# EasyEDA Pro project Tb66_and_DRV88_Teensy_LFR_PCB.epro, board PCB17
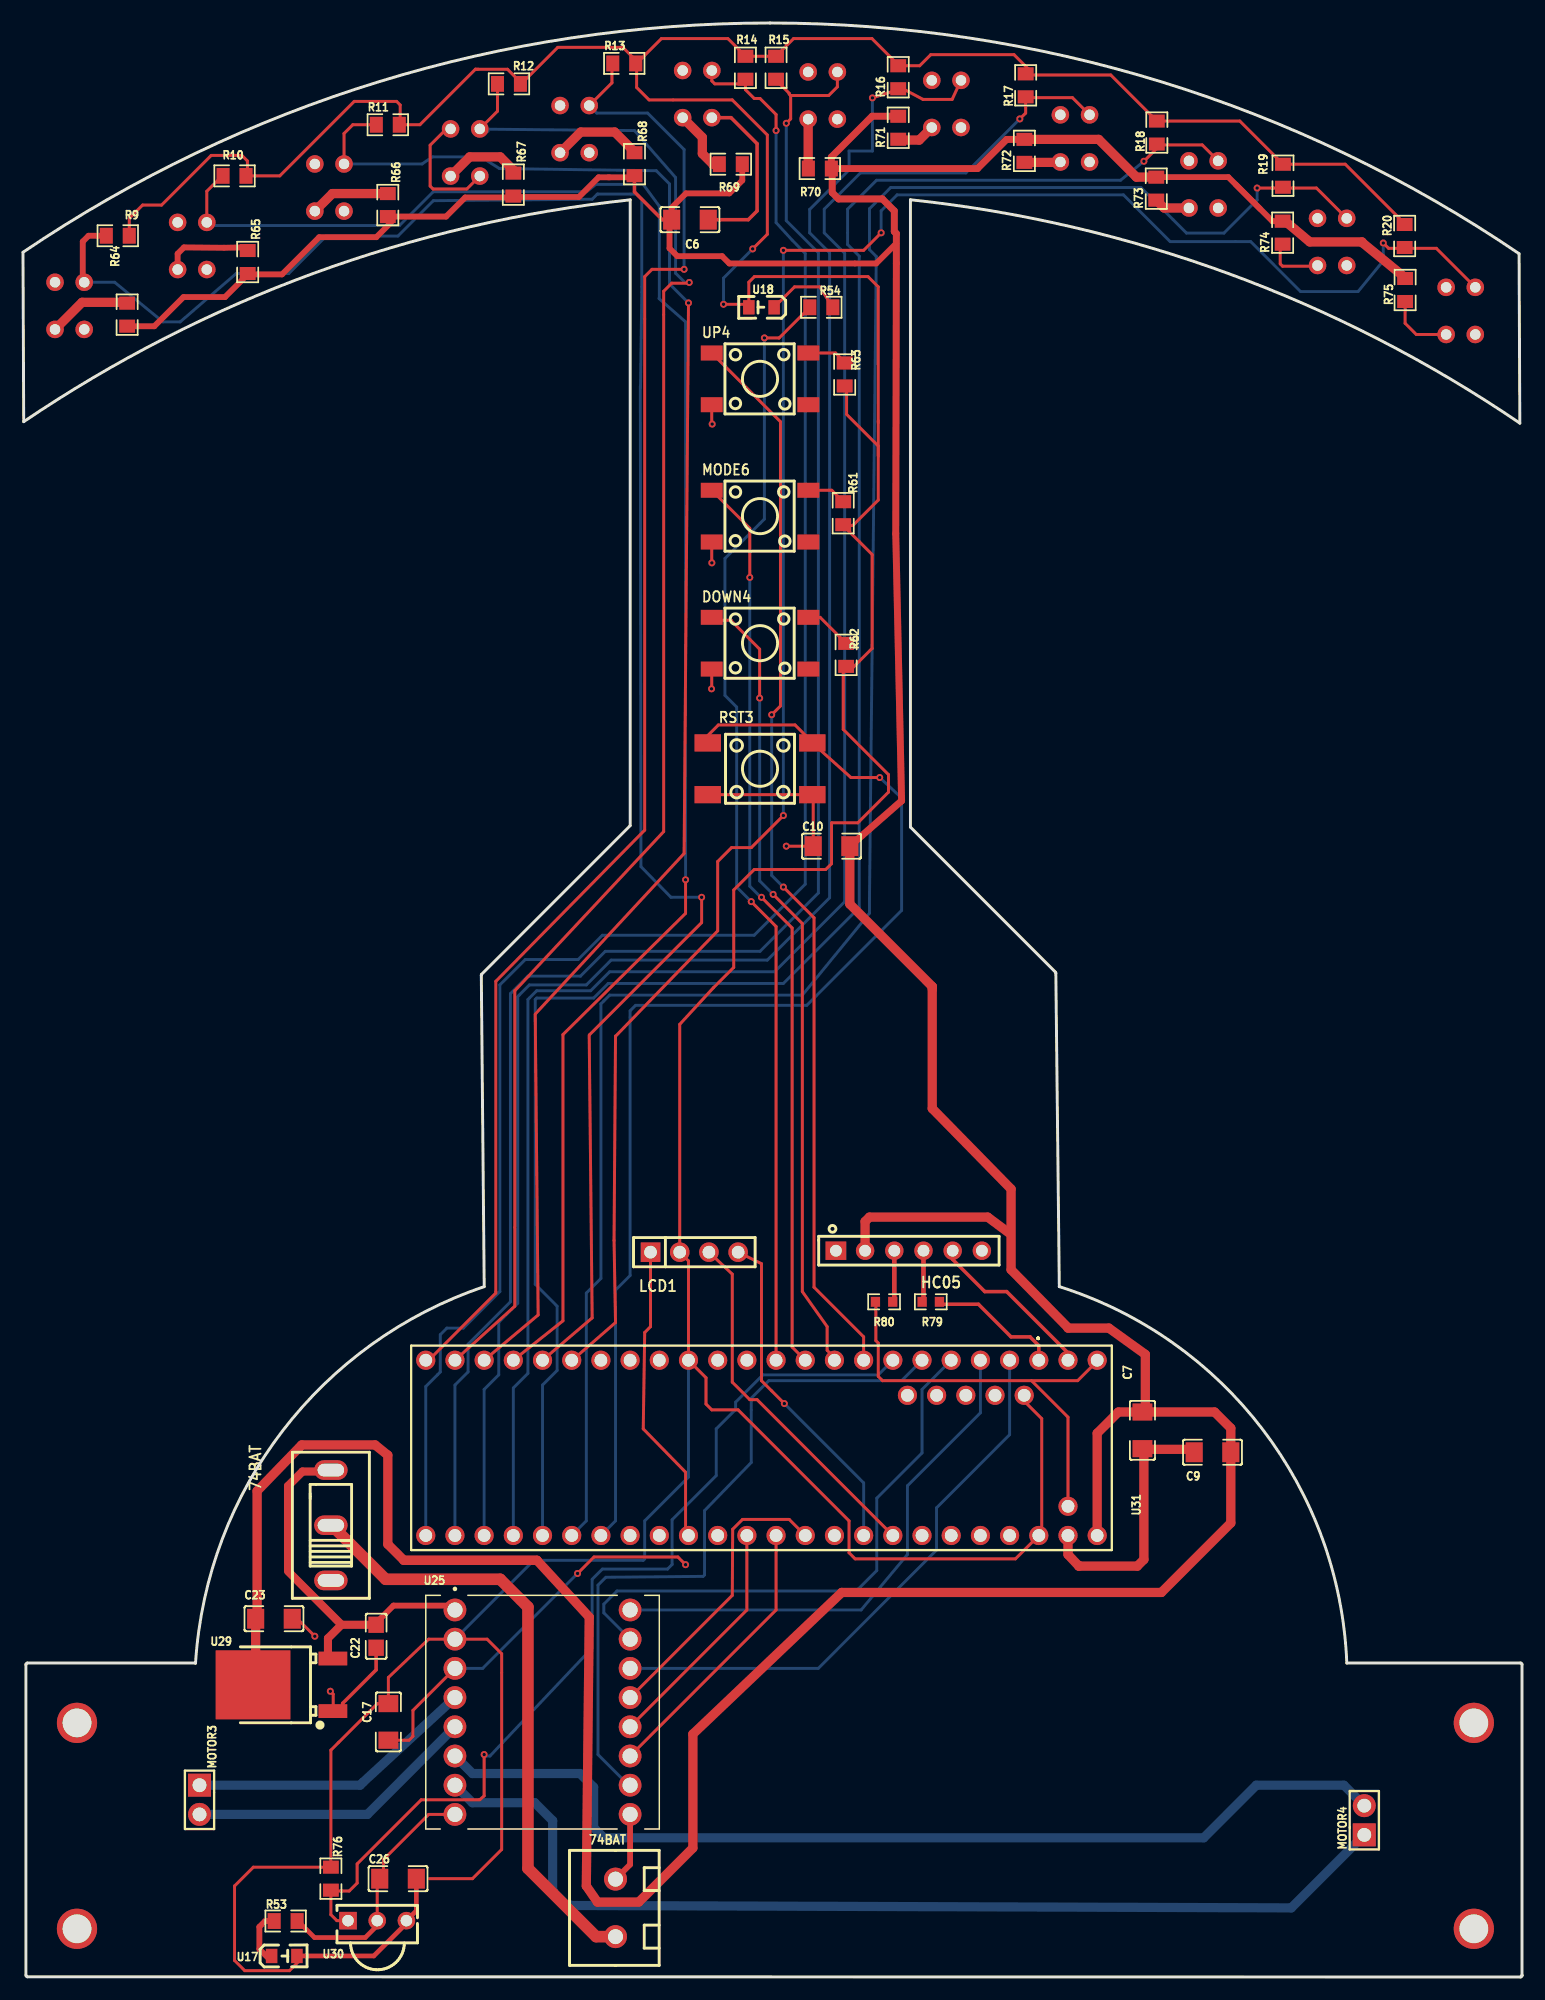
[diagram p2: board, top side]
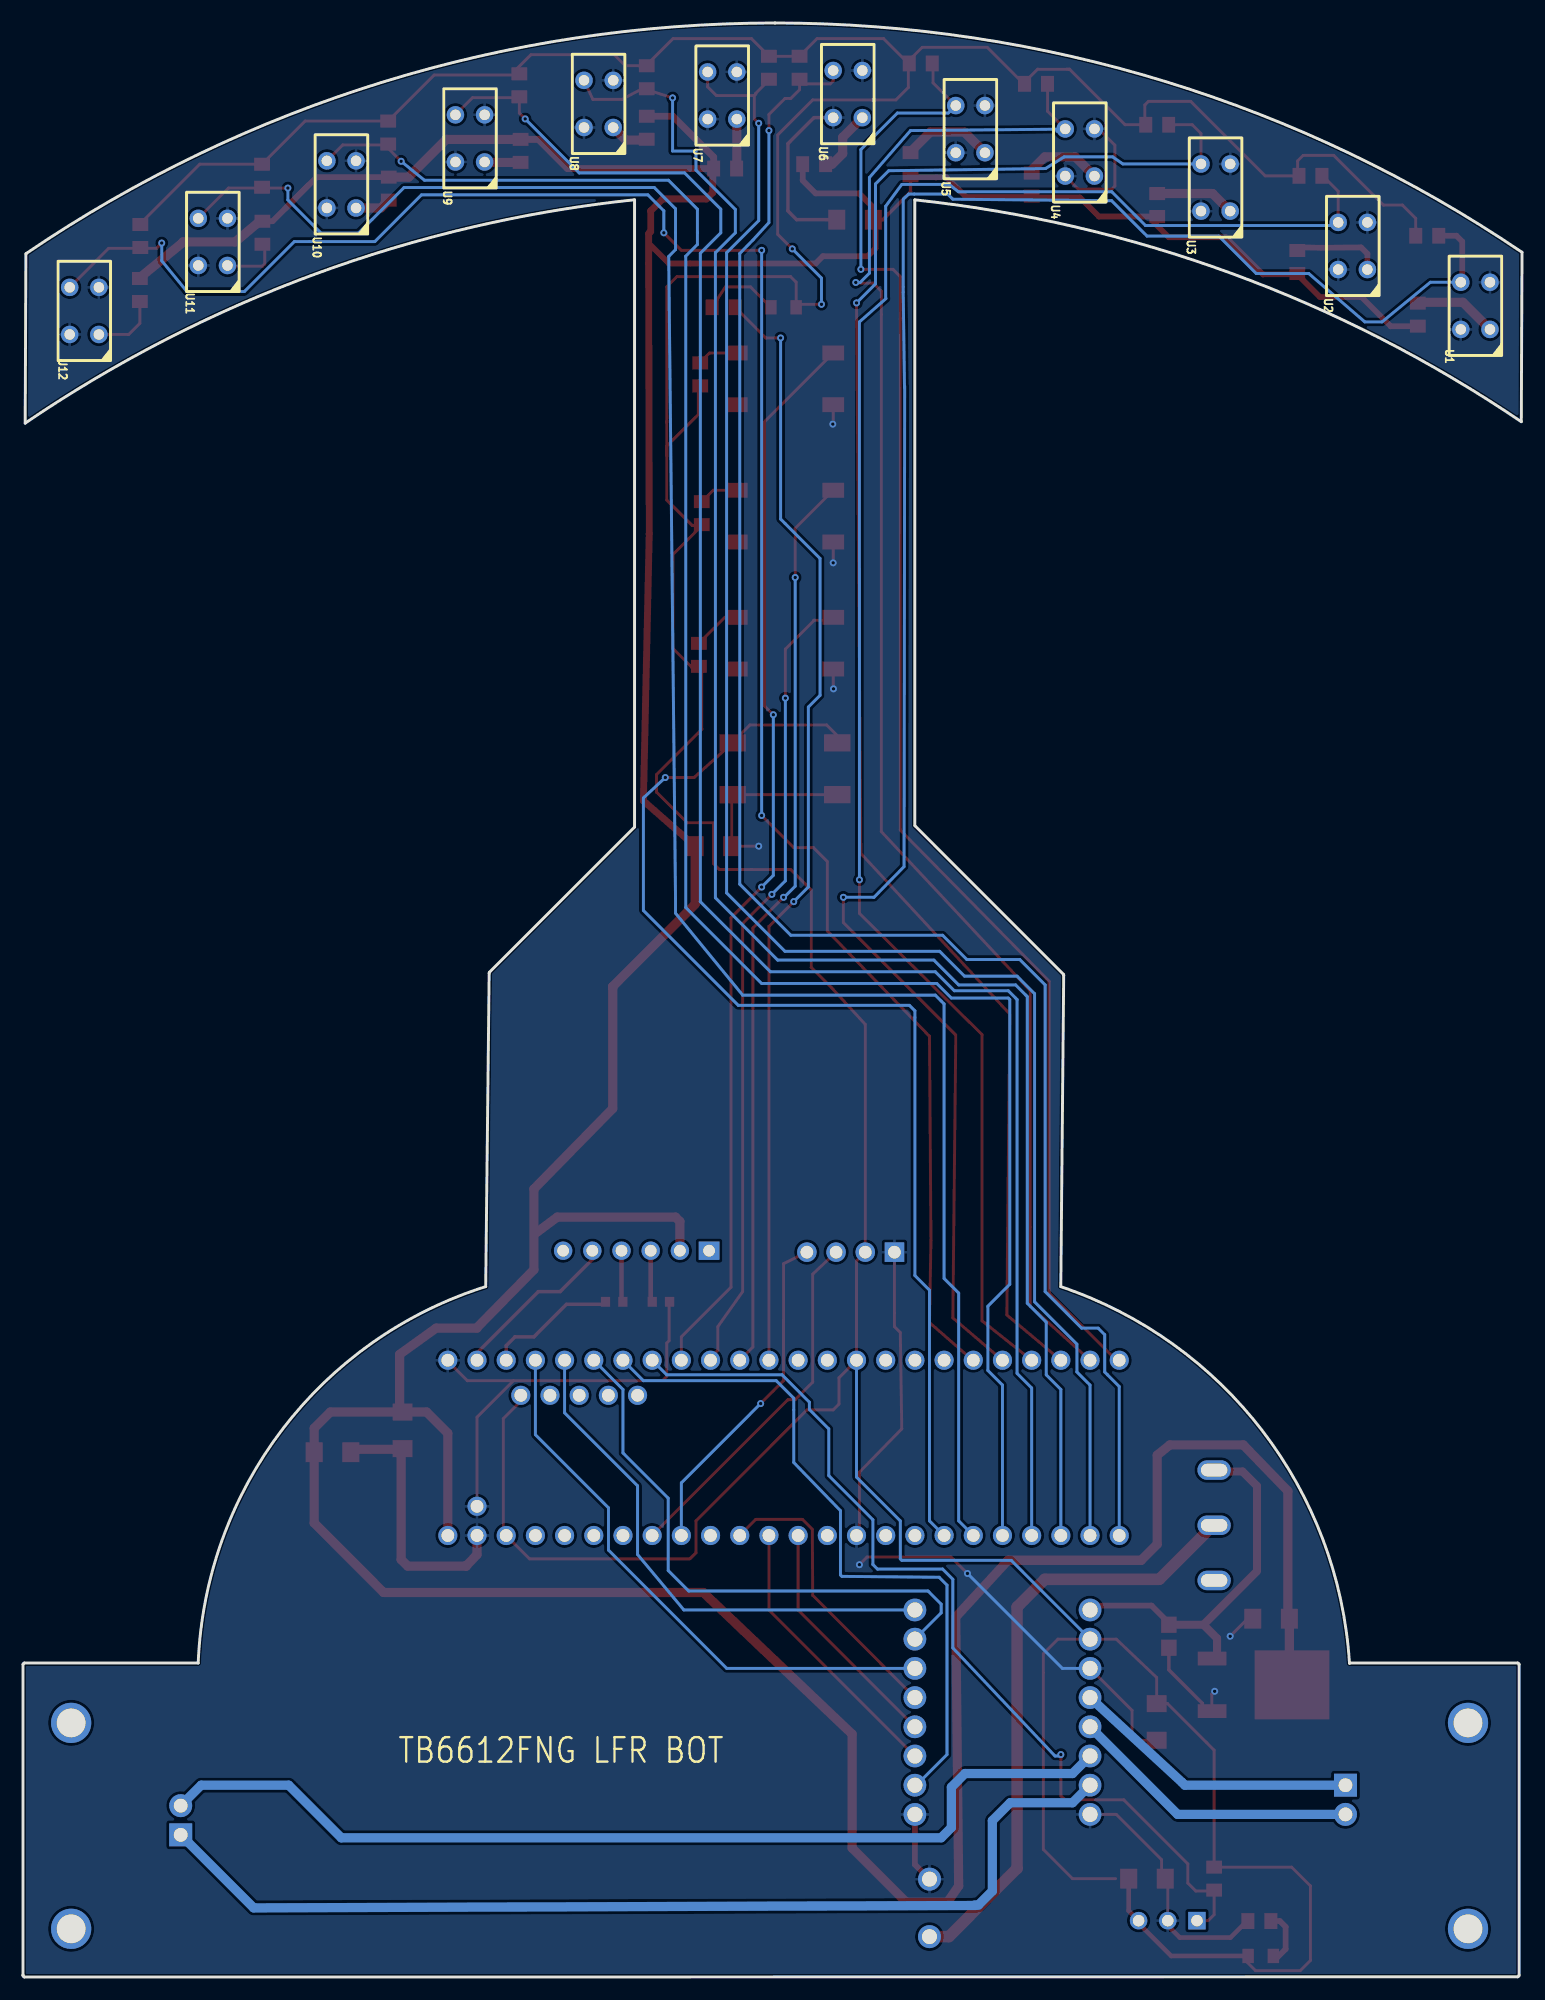
[diagram p3: board, bottom side, seen from below]

Outline 130.43 x 169.93 mm; copper layers: Top Layer, Bottom Layer. Coordinates in mm from the lower left corner of the outline.
Outline path: 0,149.99 arc(31,164.83) 64.99,169.93 arc(99.09,164.8) 130.18,149.86 130.24,135.13 arc(104.93,148.12) 77.22,154.55 77.22,100 89.83,87.39 arc(89.86,87.35) 89.87,87.3 90.17,60.04 arc(107.85,47.63) 115.18,27.31 130.3,27.31 arc(130.39,27.27) 130.43,27.18 130.43,0.18 arc(130.43,0.17) 130.43,0.15 arc(130.43,0.14) 130.43,0.13 arc(130.39,0.04) 130.3,0 0.38,0.02 arc(0.29,0.06) 0.25,0.15 0.25,27.18 arc(0.29,27.27) 0.38,27.31 14.99,27.31 arc(15,27.3) 15.01,27.3 arc(22.59,47.49) 40.13,60.03 39.88,87.12 arc(39.88,87.12) 39.88,87.12 arc(39.89,87.17) 39.92,87.21 52.83,100.13 52.83,154.55 arc(25.26,148.15) 0.06,135.25 0,149.99
Stack: Top Layer 0.035mm / Dielectric1 1.51mm FR4 er 4.5 / Bottom Layer 0.035mm

## Design rules (mm)
template: Custom Config
spacing copperThickness1oz (default): track to track 0.3, other pairs 0.152 to 0.3
spacing copperThickness2oz: track to track 0.203, other pairs 0.152 to 0.3
track width copperThickness1oz (default): min 0.127, default 0.254, max 2.54
track width copperThickness2oz: min 0.203, default 0.254, max 2.54
differential pair differentialPair (default): width min 0.127, default 0.254, max 2.54; gap min 0.152, default 0.152
via viaSize (default): diameter min 0.5, default 0.61, max 10; hole min 0.3, default 0.305, max 6.3

## Placement (name value [footprint] x y rotation side)
74BAT  7.4V BAT  [SW-TH_SHOU-HAN_SS12D10G4]  26.79 39.28 90 top
74BAT#2  SS12D10G4 071  [CONN-TH_WJ126V-5.0-2P]  51.56 6.01 180 top
C6  100nF  [C1206]  58.03 152.82 180 top
C7  100nF  [C1206]  97.4 47.54 90 top
C9  100nF  [C1206]  103.5 45.63 0 top
C10  100nF  [C1206]  70.35 98.34 0 top
C17  100nF  [C1206]  31.79 22.18 90 top
C22  10uF  [C0805]  30.73 29.63 90 top
C23  47uF  [C1206]  21.84 31.16 180 top
C26  100nF  [C1206]  32.63 8.55 0 top
DOWN4  TS-1002S-05026C  [KEY-SMD_4P-L6.0-W6.0-P4.50-LS9.0]  64.13 115.99 0 top
HC05  HC-05  [HDR-TH_6P-P2.54-V-F]  77.08 63.16 0 top
LCD1  LCD  [HDR-TH_4P-P2.54-V-F]  58.41 63.03 0 top
MODE6  TS-1002S-05026C  [KEY-SMD_4P-L6.0-W6.0-P4.50-LS9.0]  64.13 127.04 0 top
MOTOR3  MOTOR1  [HDR-TH_2P-P2.54-V-M]  15.36 15.41 270 top
MOTOR4  MOTOR2  [HDR-TH_2P-P2.54-V-M]  116.71 13.63 90 top
NOREF  -  [Pad_e6375]  126.24 22.1 0 top
NOREF#2  -  [Pad_e6377]  4.7 22.1 0 top
NOREF#3  -  [Pad_e6376]  126.24 4.19 0 top
NOREF#4  -  [Pad_e6378]  4.7 4.19 0 top
R9  47kΩ  [R0805]  8.25 151.43 180 top
R10  47kΩ  [R0805]  18.41 156.63 0 top
R11  47kΩ  [R0805]  31.74 161.08 0 top
R12  47kΩ  [R0805]  42.28 164.63 180 top
R13  47kΩ  [R0805]  52.32 166.41 0 top
R14  47kΩ  [R0805]  62.86 166.03 90 top
R15  47kΩ  [R0805]  65.53 166.03 270 top
R16  47kΩ  [R0805]  76.15 165.21 90 top
R17  47kΩ  [R0805]  87.24 164.51 90 top
R18  47kΩ  [R0805]  98.65 160.4 270 top
R19  47kΩ  [R0805]  109.63 156.65 90 top
R20  47kΩ  [R0805]  120.22 151.4 90 top
R53  470Ω  [R0805]  22.85 4.87 180 top
R54  470Ω  [R0805]  69.46 145.2 0 top
R61  10kΩ  [R0805]  71.37 127.3 270 top
R62  10kΩ  [R0805]  71.62 114.98 90 top
R63  10kΩ  [R0805]  71.49 139.36 270 top
R64  187Ω  [R0805]  9.06 144.56 270 top
R65  187Ω  [R0805]  19.55 149.14 270 top
R66  187Ω  [R0805]  31.74 154.09 270 top
R67  187Ω  [R0805]  42.67 155.87 270 top
R68  187Ω  [R0805]  53.21 157.65 270 top
R69  187Ω  [R0805]  61.59 157.65 0 top
R70  187Ω  [R0805]  69.34 157.27 0 top
R71  187Ω  [R0805]  76.15 160.82 90 top
R72  187Ω  [R0805]  87.13 158.8 90 top
R73  187Ω  [R0805]  98.61 155.52 90 top
R74  187Ω  [R0805]  109.6 151.69 90 top
R75  187Ω  [R0805]  120.26 146.71 90 top
R76  10kΩ  [R0805]  26.79 8.55 90 top
R79  1K  [R0603]  78.99 58.72 180 top
R80  2K  [R0603]  74.92 58.72 180 top
RST3  -  [SW-SMD_4P-L6.0-W6.0-P4.50-LS9.0-2]  64.13 105.07 180 top
U1  LTH1550-01  [OPTO-TH_4P-L8.7-W4.5-P4.10_LTH1550-01]  4.06 145.33 90 bottom
U2  LTH1550-01  [OPTO-TH_4P-L8.7-W4.5-P4.10_LTH1550-01]  14.73 150.54 90 bottom
U3  LTH1550-01  [OPTO-TH_4P-L8.7-W4.5-P4.10_LTH1550-01]  26.66 155.62 90 bottom
U4  LTH1550-01  [OPTO-TH_4P-L8.7-W4.5-P4.10_LTH1550-01]  38.47 158.66 90 bottom
U5  LTH1550-01  [OPTO-TH_4P-L8.7-W4.5-P4.10_LTH1550-01]  48 160.7 90 bottom
U6  LTH1550-01  [OPTO-TH_4P-L8.7-W4.5-P4.10_LTH1550-01]  58.67 163.75 90 bottom
U7  LTH1550-01  [OPTO-TH_4P-L8.7-W4.5-P4.10_LTH1550-01]  69.59 163.62 90 bottom
U8  LTH1550-01  [OPTO-TH_4P-L8.7-W4.5-P4.10_LTH1550-01]  80.34 162.89 90 bottom
U9  LTH1550-01  [OPTO-TH_4P-L8.7-W4.5-P4.10_LTH1550-01]  91.53 159.89 90 bottom
U10  LTH1550-01  [OPTO-TH_4P-L8.7-W4.5-P4.10_LTH1550-01]  102.72 155.89 90 bottom
U11  LTH1550-01  [OPTO-TH_4P-L8.7-W4.5-P4.10_LTH1550-01]  113.91 150.89 90 bottom
U12  LTH1550-01  [OPTO-TH_4P-L8.7-W4.5-P4.10_LTH1550-01]  125.09 144.89 90 bottom
U17  YLED0805R  [LED0805-RD]  22.73 1.83 0 top
U18  YLED0805R  [LED0805-RD]  64.25 145.2 180 top
U25  ROB-14450  [MODULE_ROB-14450]  45.21 23.03 0 top
U29  ZLDO1117QK50TC  [TO-252-3_L6.6-W6.1-P4.57-LS9.9-BR-CW]  23.49 25.41 0 top
U30  XL-IRM1838B  [OPTO-TH_3P-L7.0-W5.6-P2.54-L]  30.82 4.9 0 top
U31  TEENSY 4.1  [TEENSY41 solved]  88.38 53.64 180 top
UP4  TS-1002S-05026C  [KEY-SMD_4P-L6.0-W6.0-P4.50-LS9.0]  64.13 138.98 0 top

## Footprints (pads in the part's own frame, mm; a bottom-side part is the same pattern mirrored in y, then rotated)
C0805
  rect 1.41x1.35 smd: 1(-1,0) 2(1,0)
C1206
  rect 1.485x1.728 smd: 1(-1.593,0) 2(1.593,0)
CONN-TH_WJ126V-5.0-2P
  round 2 hole 1.3: 1(0,2.501) 2(0,-2.501)
HDR-TH_2P-P2.54-V-M
  rect 2x2 hole 1.2: 1(-1.27,0)
  round 2 hole 1.2: 2(1.27,0)
HDR-TH_4P-P2.54-V-F
  rect 1.7x1.7 hole 1.1: 1(-3.81,0)
  round 1.7 hole 1.1: 2(-1.27,0) 3(1.27,0) 4(3.81,0)
HDR-TH_6P-P2.54-V-F
  rect 1.8x1.6 hole 1.02: 1(-6.35,0)
  round 1.6 hole 1.02: 2(-3.81,0) 3(-1.27,0) 4(1.27,0) 5(3.81,0) 6(6.35,0)
KEY-SMD_4P-L6.0-W6.0-P4.50-LS9.0
  rect 1.9x1.3 smd: 1(-4.2,2.25) 2(4.2,2.25) 3(-4.2,-2.25) 4(4.2,-2.25)
LED0805-RD
  rect 1x1.25 smd: 1(-1.1,0) 2(1.1,0)
MODULE_ROB-14450
  round 1.98 hole 1.32: 1(-7.62,8.89) 2(-7.62,6.35) 3(-7.62,3.81) 4(-7.62,1.27) 5(-7.62,-1.27) 6(-7.62,-3.81) 7(-7.62,-6.35) 8(-7.62,-8.89) 9(7.62,-8.89) 10(7.62,-6.35) 11(7.62,-3.81) 12(7.62,-1.27) 13(7.62,1.27) 14(7.62,3.81) 15(7.62,6.35) 16(7.62,8.89)
OPTO-TH_3P-L7.0-W5.6-P2.54-L
  rect 1.524x1.524 hole 1: 1(-2.54,0)
  round 1.524 hole 1: 2(0,0) 3(2.54,0)
OPTO-TH_4P-L8.7-W4.5-P4.10_LTH1550-01
  round 1.524 hole 0.914: 1(-2.05,1.27) 2(2.05,1.27) 3(-2.05,-1.27) 4(2.05,-1.27)
Pad_e6375
  round 3.5 hole 2.5: 1(0,0)
Pad_e6376
  round 3.5 hole 2.5: 2(0,0)
Pad_e6377
  round 3.5 hole 2.5: 1(0,0)
Pad_e6378
  round 3.5 hole 2.5: 1(0,0)
R0603
  rect 0.806x0.864 smd: 1(-0.753,0) 2(0.753,0)
R0805
  rect 1.133x1.377 smd: 1(-1,0) 2(1,0)
SW-SMD_4P-L6.0-W6.0-P4.50-LS9.0-2
  rect 2.3x1.5 smd: 1(-4.55,2.25) 2(4.55,2.25) 3(-4.55,-2.25) 4(4.55,-2.25)
SW-TH_SHOU-HAN_SS12D10G4
  oval 1.7x2.9 hole 1.1x2.3: 1(-4.8,0) 2(0,0) 3(4.8,0)
TEENSY41 solved
  round 1.665 hole 1.11: 0(-2.54,0) 1(0,0) 2(2.54,0) 3(5.08,0) 4(7.62,0) 5(10.16,0) 6(12.7,0) 7(15.24,0) 8(17.78,0) 9(20.32,0) 10(22.86,0) 11(25.4,0) 12(27.94,0) 13(27.94,15.24) 14(25.4,15.24) 15(22.86,15.24) 16(20.32,15.24) 17(17.78,15.24) 18(15.24,15.24) 19(12.7,15.24) 20(10.16,15.24) 21(7.62,15.24) 22(5.08,15.24) 23(2.54,15.24) 24(33.02,0) 25(35.56,0) 26(38.1,0) 27(40.64,0) 28(43.18,0) 29(45.72,0) 30(48.26,0) 31(50.8,0) 32(53.34,0) 33(53.34,15.24) 33V(0,15.24) 33V(30.48,0) 34(50.8,15.24) 35(48.26,15.24) 36(45.72,15.24) 37(43.18,15.24) 38(40.64,15.24) 39(38.1,15.24) 40(35.56,15.24) 41(33.02,15.24) 48(11.43,3.05) 49(8.89,3.05) 50(6.35,3.05) 51(3.81,3.05) 52(1.27,3.05) GND(-5.08,0) GND1(-2.54,15.24) GND2(-2.54,12.7) GND3(30.48,15.24) VIN1(-5.08,15.24)
TO-252-3_L6.6-W6.1-P4.57-LS9.9-BR-CW
  rect 2.5x1.2 smd: 1(3.475,-2.286) 3(3.475,2.286)
  rect 6.5x6 smd: 2(-3.475,0)

## Nets
+3.3V: C17.2 C26.2 LCD1.2 R9.1 R10.2 R11.2 R12.1 R13.2 R14.2 R15.1 R16.2 R17.2 R18.1 R19.2 R20.2 R61.2 R62.1 R63.2 R76.2 U17.2 U18.2 U25.2 U30.3 U31.33V U31.52
+5V: C6.2 C7.2 C9.2 C10.2 C23.2 HC05.2 R64.2 R65.2 R66.2 R67.2 R68.2 R69.2 R70.2 R71.2 R72.2 R73.2 R74.2 R75.2 U29.2 U31.VIN1
+7.4V: 74BAT.3 C22.2 U25.1 U29.3
GND: 74BAT#2.2 C6.1 C7.1 C9.1 C10.1 C17.1 C22.1 C23.1 C26.1 DOWN4.3 LCD1.1 MODE6.3 R53.1 R80.2 RST3.1 RST3.2 U1.1 U1.4 U2.1 U2.4 U3.1 U3.4 U4.1 U4.4 U5.1 U5.4 U6.1 U6.4 U7.1 U7.4 U8.1 U8.4 U9.1 U9.4 U10.1 U10.4 U11.1 U11.4 U12.1 U12.4 U25.3 U25.8 U25.9 U29.1 U30.2 U31.GND U31.GND1 U31.GND2 U31.GND3 UP4.3
7: U31.7 UP4.1
8: DOWN4.1 U31.8
9: MODE6.1 U31.9
10: R54.1 U31.10
27(A11): R20.1 U12.2 U31.27
28(A0): R9.2 U1.2 U31.28
29(A1): R10.1 U2.2 U31.29
30(A2): R11.1 U3.2 U31.30
31(A3): R12.2 U4.2 U31.31
32(A4): R13.1 U5.2 U31.32
33(A5): R14.1 U6.2 U31.33
34(A6): R15.2 U7.2 U31.34
35(A7): R16.1 U8.2 U31.35
36(A8): R17.1 U9.2 U31.36
37(A9): R18.2 U10.2 U31.37
38(A10): R19.1 U11.2 U31.38
BTRX(0): HC05.5 U31.0
BTTX(1): R79.1 U31.1
DIR-A(2): U25.14 U31.2
DIR-A(4): U25.15 U31.4
DIR-B(14): U25.12 U31.14
DIR-B(15): U25.11 U31.15
IRSIGNAL_IN(6): R76.1 U30.1 U31.6
ON/OFF: U31.49
PWM(3): U25.16 U31.3
PWM(5): U25.10 U31.5
RESET: RST3.3 RST3.4 U31.39
SCL(19): LCD1.3 U31.19
SDA(18): LCD1.4 U31.18
STANDYB-CONTROL(16): U25.13 U31.16
$1N4606: R68.1 U5.3
$1N4607: R67.1 U4.3
$1N4618: R65.1 U2.3
$1N4619: R66.1 U3.3
$1N4626: R64.1 U1.3
$1N4631: HC05.4 R79.2
$1N4632: HC05.3 R80.1
$1N4662: R63.1 UP4.2
$1N4664: DOWN4.2 R62.2
$1N4665: MODE6.2 R61.1
$1N4672: R54.2 U18.1
$1N4684: R73.1 U10.3
$1N4685: R74.1 U11.3
$1N4686: R75.1 U12.3
$1N4698: R71.1 U8.3
$1N4699: R72.1 U9.3
$1N4706: R69.1 U6.3
$1N4711: 74BAT.2 74BAT#2.1
$1N4716: R53.2 U17.1
$1N5383: MOTOR4.2 U25.6
$1N5385: MOTOR4.1 U25.7
$1N5399: MOTOR3.1 U25.4
$1N5401: MOTOR3.2 U25.5
$1N10466: R70.1 U7.3

Pads without a net: 74BAT 1; DOWN4 4; HC05 1 6; MODE6 4; NOREF 1; NOREF#2 1; NOREF#3 2; NOREF#4 1; U31 11 12 13 17 20 21 22 23 24 25 26 40 41 48 50 51; UP4 4

## Via types
v1: diameter 0.61, hole 0.305, Top Layer to Bottom Layer, 36 vias

## Routing (per net, layer and track width the routed paths; a pad name or vN(x,y) marks a point on that pad's centre or on a via; arc(x,y) is an arc through that point)
+3.3V: length 487.4
  Top Layer w0.254: R9.1 9.25,152.93 10.41,154.09 12.06,154.09 16.38,158.41 19.04,158.41 19.53,157.93 19.53,156.63 ; R10.2 22.34,156.63 28.82,163.11 32.5,163.11 32.82,162.8 32.82,161.08 34.54,161.08 39.36,165.9 ; 24.04,1.41 23.18,0.55 19.3,0.55 18.41,1.44 18.41,7.92 20.04,9.55 26.54,9.55 ; 26.79,9.63 26.79,19.73 27.48,20.41 ; 27.42,20.36 30.84,23.78 C17.2 31.79,26.05 35.3,29.38 U25.2 ; 39.36,165.9 39.62,165.9 ; 39.36,165.9 42.16,165.9 43.36,164.7 43.36,164.63 46.53,167.81 52.19,167.81 53.46,166.54 53.46,166.41 ; 37.4,29.38 U25.2 ; U25.2 40.38,29.38 41.65,28.11 41.65,11.09 39.11,8.55 35.37,8.55 ; v1(60.95,145.46) 62.89,145.46 U18.2 ; 63.02,145.33 63.16,145.46 63.16,147.39 63.64,147.87 73.53,147.87 74.41,146.98 74.41,135.17 ; 63.62,150.41 64.76,151.55 64.76,160.19 61.72,163.24 54.48,163.24 53.39,164.32 53.39,166.41 55.55,168.57 61.33,168.57 62.86,167.05 R14.2 65.51,167.03 67.05,168.57 73.87,168.57 76.15,166.28 ; 71.37,113.9 71.37,108.5 75.3,104.56 75.3,103.04 72.64,100.37 70.35,100.37 70.35,96.82 69.84,96.31 63.62,96.31 61.84,94.53 61.84,87.8 60.06,86.02 57.14,82.84 LCD1.2 57.91,62.27 U31.33V 59.43,52.11 59.43,49.83 59.94,49.32 62.22,49.32 71.88,39.67 71.88,36.89 72.4,36.36 86.35,36.36 U31.33V 88.64,38.65 88.64,48.56 87.12,50.08 ; 71.66,138.29 71.66,135.89 74.41,133.14 74.41,132.28 ; 71.62,113.9 72.24,113.9 73.88,115.55 73.88,123.7 71.37,126.22 72.2,126.22 74.41,128.44 74.41,135.33 ; R16.2 78.02,166.21 78.99,167.17 86.23,167.17 87.46,165.94 87.46,165.4 ; 87.12,50.08 87.12,50.59 87.12,50.08 ; 87.24,165.4 94.65,165.4 R18.1 105.88,161.4 R19.2 115.05,157.65 120.22,152.48
  Top Layer w0.4: U17.2 30.52,1.83 33.36,4.67 ; C26.2 34.22,5.76 U30.3
  Bottom Layer w0.254: U25.2 44.44,36.24 53.97,36.24 54.09,36.36 54.09,39.67 57.91,43.48 U31.33V ; 60.95,145.46 60.95,147.74 v1(63.49,150.28)
GND: length 208.9
  Top Layer w0.254: C23.1 23.87,31.16 v1(25.39,29.63) ; v1(26.74,24.85) 26.99,24.6 26.99,23.11 ; U30.2 30.82,8.29 31.08,8.55 ; 30.89,8.55 31.36,9.03 31.36,10.2 35.3,14.14 U25.8 ; C17.1 33.59,20.59 33.93,20.93 33.93,23.18 U25.3 ; U4.4 36.84,160.72 35.43,159.3 35.43,155.74 35.68,155.49 38.62,155.49 U4.1 ; v1(48.25,35.09) 49.68,36.52 56.98,36.52 v1(57.65,35.86) ; LCD1.1 54.6,56.56 54.09,56.05 53.97,47.67 57.65,43.9 57.65,38.65 ; RST3.2 68.79,102.82 68.83,102.78 ; C6.1 60.57,152.82 ; UP4.3 59.93,135.08 v1(59.97,135.05) ; MODE6.3 59.93,122.99 v1(59.94,122.98) ; 59.93,113.52 59.93,112.04 v1(59.91,112.02) ; 68.68,102.82 68.76,102.74 C10.1 v1(66.41,98.34) ; 74.21,58.71 74.21,55.34 74.41,55.13 74.41,52.23 74.79,51.86 87.75,51.86 ; 87.75,51.86 90.93,48.68 U31.GND2 ; 87.75,51.86 91.77,51.86 93.47,53.56 U31.GND
  Top Layer w0.3: 27.81,23.11 27.81,23.8 30.73,26.71 30.73,28.56 ; U6.1 61.61,161.69 63.87,159.43 63.87,153.59 63.11,152.82 60.1,152.82
  Top Layer w0.4: 23.93,4.87 25.36,3.43 29.78,3.43 30.82,4.47 U30.2
  Top Layer w0.5: U25.9 52.82,9.78 74BAT.2
  Top Layer w0.8: 90.54,38.52 90.67,38.4 ; 90.93,38.52 90.93,36.74 91.87,35.73 ; 91.87,35.73 91.87,35.8 ; 91.87,35.73 96.95,35.73 97.53,36.3 97.53,45.89 101.59,45.89 101.72,45.76
  Bottom Layer w0.254: U25.3 40,26.84 v1(48.25,35.09)
7: length 93.9
  Top Layer w0.254: UP4.1 65.91,135.25 65.91,110.53 v1(65.14,109.77) 65.03,109.88 ; v1(66.16,94.78) 68.83,92.12 68.83,59.99 73.15,55.67 U31.7
  Bottom Layer w0.254: v1(65.14,109.77) 65.14,95.8 v1(66.16,94.78)
8: length 69.7
  Top Layer w0.254: DOWN4.1 60.18,117.99 61.64,117.99 ; 61.58,117.99 64.1,115.47 v1(64.1,111.22) ; v1(65.27,94.15) 67.81,91.61 67.81,59.61 69.97,56.56 69.97,54.5 70.6,53.86 U31.8
  Bottom Layer w0.254: v1(64.1,111.22) 64.1,95.32 v1(65.27,94.15)
9: length 78.9
  Top Layer w0.254: MODE6.1 63.24,125.98 v1(63.24,121.71) ; v1(64.25,93.9) 66.92,91.23 66.92,54.78 U31.9
  Bottom Layer w0.254: v1(63.24,121.71) 63.24,94.86 64.13,93.97
10: length 97.2
  Top Layer w0.254: 63.37,93.51 65.53,91.36 U31.10 ; v1(64.51,142.54) 65.78,142.54 65.78,142.54 ; R54.1 65.8,142.54
  Bottom Layer w0.254: 63.37,93.51 v1(63.37,93.52) 62.1,94.79 62.1,110.44 61.08,111.45 61.08,123.36 64.51,126.79 v1(64.51,142.54)
27(A11): length 176.5
  Top Layer w0.254: 47.75,53.59 51.56,56.91 51.43,64.05 51.56,81.83 ; 51.56,81.81 60.44,90.97 60.44,97.01 61.65,98.21 63.37,98.21 v1(66.16,101.01) ; v1(66.16,150.16) 73.15,150.16 v1(74.67,151.68) ; v1(118.36,150.79) 118.82,150.33 122.97,150.33 U12.2
  Bottom Layer w0.254: v1(66.16,101.01) v1(66.16,150.16) ; v1(74.67,151.68) 74.67,153.59 76.06,154.98 95.75,154.98 99.81,150.92 106.82,150.92 111.17,146.57 116.16,146.57 118.36,149.25 v1(118.36,150.79)
28(A0): length 171.1
  Top Layer w0.254: U31.28 49.52,57.32 49.27,81.91 ; 59.05,93.88 59.05,91.69 49.31,81.95
  Top Layer w0.5: U1.2 5.2,147.51 5.2,150.92 5.71,151.43 R9.2
  Bottom Layer w0.254: 5.07,147.38 7.98,147.38 12.18,143.93 13.68,143.93 18.55,148.14 23.12,148.14 26.38,151.4 32.63,151.4 35.7,154.47 49.52,154.6 49.97,155.05 53.37,155.05 53.83,154.61 ; 53.73,138.22 53.84,146.49 ; 53.71,138.34 53.77,96.56 56.38,93.9 58.95,93.9 ; 53.84,154.61 53.84,146.51
  vias: v1(59.05,93.9)
29(A1): length 155
  Top Layer w0.254: 17.34,156.63 16,155.29 U2.2 ; 42.41,53.89 U31.29 46.98,57.06 46.98,81.96 57.65,92.5 v1(57.65,95.42)
  Bottom Layer w0.254: 16,152.97 16.65,152.31 32.76,152.31 35.7,155.25 49.05,155.25 49.84,155.89 53.94,155.89 ; 53.97,155.89 55.37,153.99 55.37,145.97 ; 55.34,145.97 57.65,143.93 57.65,95.31
30(A2): length 153.3
  Top Layer w0.254: U3.2 27.93,160.32 28.7,161.08 R11.1 ; U31.30 44.82,57.57 44.57,83.7 ; 44.57,83.74 57.52,97.7 v1(57.91,145.58)
  Bottom Layer w0.254: U3.2 34.73,157.67 35.62,158.28 39.84,158.28 41.46,157.27 55.1,157.08 56.25,155.93 56.25,155.8 ; 56.25,155.8 56.25,147.74 ; 56.25,155.8 56.25,147.74 ; 56.25,147.74 56.25,147.24 v1(57.91,145.58)
31(A3): length 137
  Top Layer w0.254: U4.2 41.28,162.25 R12.2 ; 42.79,58.34 U31.31 ; 42.79,58.33 42.79,85.76 55.75,99.61 55.75,146.6 56.44,147.3 57.91,147.3 v1(57.97,147.36)
  Bottom Layer w0.254: U4.2 40.47,160.5 ; 39.71,160.7 53.21,160.57 56.78,156.49 56.78,148.17 57.59,147.36 v1(57.97,147.36)
32(A4): length 130.6
  Top Layer w0.254: 35.17,53.51 41.14,59.48 41.14,86.59 54.09,99.74 54.09,147.87 54.73,148.5 v1(57.52,148.5) ; U5.2 51.24,164.72 51.24,166.41
  Bottom Layer w0.254: U5.2 49.92,162.09 54.35,162.09 57.52,158.92 v1(57.52,148.5)
33(A5): length 158
  Top Layer w0.254: U6.2 59.94,164.89 60.19,164.63 62.73,164.63 62.86,164.76 ; R14.1 62.86,164.13 63.62,163.36 64.13,163.36 65.53,161.97 v1(65.53,160.57)
  Bottom Layer w0.254: U31.33 35.05,51.35 36.31,52.61 36.31,55.86 36.88,56.43 38.32,56.43 41.49,59.61 41.49,86.28 43.7,88.48 48.3,88.48 50.41,90.59 63.62,90.59 68.06,95.04 68.06,149.88 66.92,151.05 65.53,152.57 v1(65.53,160.57)
34(A6): length 157.7
  Top Layer w0.254: 65.53,164.96 66.67,163.81 66.67,163.75 66.8,163.62 ; 66.8,163.62 66.8,161.59 v1(66.41,161.21) ; 66.8,163.62 70.1,163.62 70.86,164.37 U7.2
  Bottom Layer w0.254: U31.34 37.59,51.48 38.73,52.62 38.73,55.03 42.41,58.72 42.41,85.51 43.94,87.04 48.51,87.04 50.67,89.2 64.13,89.2 69.21,94.28 69.21,149.94 66.41,152.74 v1(66.41,161.21)
35(A7): length 161.6
  Top Layer w0.254: v1(73.91,163.41) 76.15,164.14 76.69,164.14 78.32,163.28 ; 78.32,163.28 78.31,163.28 ; 78.32,163.28 80.84,163.28 U8.2
  Bottom Layer w0.254: U31.35 40.12,51.1 41.39,52.37 41.39,56.94 43.05,58.59 43.05,85.26 44.06,86.28 49.02,86.28 51.17,88.43 64.76,88.43 70.18,93.85 70.18,149.95 70.17,149.95 68.45,151.68 68.45,153.71 71.88,157.14 71.88,158.79 73.91,158.79 v1(73.91,163.41)
36(A8): length 167.7
  Top Layer w0.254: v1(86.73,161.59) 87.24,162.09 87.24,163.43 91.31,163.43 U9.2
  Bottom Layer w0.254: U31.36 42.67,51.22 43.94,52.49 43.94,85.01 44.7,85.77 49.4,85.77 51.05,87.42 65.4,87.42 71.49,93.51 71.49,149.9 69.72,151.68 69.72,153.74 72.86,156.89 82.03,156.89 v1(86.73,161.59)
37(A9): length 175.8
  Top Layer w0.254: v1(97.53,157.9) 98.65,159.03 98.65,159.32 102.61,159.32 U10.2
  Bottom Layer w0.254: U31.37 45.21,51.48 46.47,52.75 46.47,58.34 44.57,60.24 44.57,85.01 44.7,85.13 49.65,85.13 50.92,86.4 66.16,86.4 72.76,93.01 72.76,149.65 71.75,150.66 71.75,153.74 74.27,156.25 95.5,156.25 v1(97.53,157.9)
38(A10): length 183.1
  Top Layer w0.254: v1(107.38,155.57) 112.54,155.57 U11.2
  Bottom Layer w0.254: U31.38 49.02,39.67 49.02,59.48 50.28,60.75 50.28,84.62 51.05,85.39 67.81,85.39 73.65,92.51 73.65,93.77 74.25,149.62 73.65,150.21 73.65,153.77 75.5,155.62 97.28,155.62 101.24,151.66 104.5,151.66 107.38,154.54 v1(107.38,155.57)
IRSIGNAL_IN(6): length 83.6
  Top Layer w0.254: U30.1 27.31,4.9 26.79,5.42 26.79,7.48 28.38,7.48 29.08,8.17 29.08,9.84 34.65,15.41 39.73,15.41 40.12,15.75 v1(40.12,19.35)
  Bottom Layer w0.254: v1(40.12,19.35) 40.25,19.22 40.63,19.22 49.52,28.62 49.52,34.59 50.41,35.47 56.08,35.47 56.48,35.87 56.48,39.77 60.32,43.6 60.32,47.67 62.01,49.35 62.01,49.99 64.38,52.37 74.41,52.37 U31.6
RESET: length 104.4
  Top Layer w0.254: 58.94,107.32 60.5,108.88 67.18,108.88 68.68,107.38 68.68,107.32 72.04,104.31 v1(74.54,104.31)
  Bottom Layer w0.254: U31.39 51.56,39.67 51.56,59.73 52.82,61 52.82,84.02 53.3,84.5 68.19,84.5 76.45,92.75 76.45,102.53 v1(74.54,104.31)
SDA(18): length 34.8
  Top Layer w0.254: LCD1.4 64.25,62.03 64.25,57.06 ; 64.25,57.06 64.25,51.86 ; 64.25,57.06 64.25,51.86 ; 64.25,51.86 v1(66.25,49.87)
  Bottom Layer w0.254: v1(66.25,49.87) 73.15,42.97 U31.18
+5V: length 499.1
  Top Layer w0.3: R68.2 53.21,155.24 55.62,152.82 C6.2
  Top Layer w0.5: 9.06,143.32 9.3,143.55 11.42,143.55 13.96,146.09 17.58,146.09 19.55,148.06 ; 19.93,148.06 22.54,148.06 25.77,151.3 30.74,151.3 32,152.56 32,153.02 ; R66.2 36.81,153.09 38.47,154.75 42.55,154.75 R67.2 ; 42.28,154.8 48.37,154.8 50.08,156.51 51.03,156.51 ; 50.92,156.51 53.08,156.51 53.21,156.63 ; 56.25,153.07 56.25,150.33 56.93,149.65 60.83,149.65 61.46,149.01 74.23,149.01 75.99,150.77 ; C6.2 56.44,153.87 57.68,155.11 61.46,155.11 62.59,156.24 R69.2 ; R73.2 104.88,156.52 107.64,153.76 ; 105.53,155.87 108.71,152.69 109.71,152.69
  Top Layer w0.6: 70.41,157.06 70.41,155.18 70.96,154.62 74.77,154.62 75.81,153.59 75.81,151.79 75.99,151.61 75.99,149.01 75.94,125.52 76.45,102.28 C10.2 ; R71.2 73.88,161.82 70.34,158.27 R70.2 83.05,157.27 85.59,159.8 R72.2
  Top Layer w0.8: C23.2 20.24,25.64 ; 20.37,30.9 20.37,42.26 24.25,46.27 30.64,46.27 31.74,45.38 31.74,37.63 33.14,36.24 ; 33.14,36.24 44.72,36.24 ; 33.14,36.24 44.72,36.24 ; 44.72,36.24 49.27,31.3 49.02,7.92 49.99,6.51 53.59,6.52 58.29,11.22 58.29,21.12 71.24,33.44 99.05,33.44 105.09,39.48 105.09,45.13 ; 70.41,157.27 R70.2 ; C10.2 71.94,93.3 79.11,86.13 ; 79.11,86.13 79.11,85.93 ; 79.11,86.13 79.11,75.52 85.97,68.53 85.97,61.51 90.96,56.43 ; HC05.2 73.27,65.7 73.65,66.08 83.94,66.08 85.92,64.61 ; R72.2 93.6,159.8 96.88,156.52 R73.2 ; U31.VIN1 93.47,47.29 95.31,49.13 C7.2 103.68,49.13 105.09,47.73 C9.2 ; 90.92,56.43 94.48,56.43 97.66,54.14 97.66,49.13 97.53,49.01 ; R74.2 109.82,152.69 111.96,150.89 116.5,150.89 116.58,150.79 120.26,147.78
+7.4V: length 31.3
  Top Layer w0.5: 30.6,30.66 32.23,32.3 37.2,32.3 U25.1
  Top Layer w0.7: 23.06,35.41 23.06,42.7 24.32,43.96 26.41,43.96 ; 23.06,35.29 27.68,30.67 ; 26.54,27.85 26.54,29.46 27.71,30.63 30.22,30.63
BTRX(0): length 14.7
  Top Layer w0.3: 80.89,63.29 80.89,62.4 83.69,59.61 85.59,59.61 91.05,54.14 91.05,53.89
BTTX(1): length 11.4
  Top Layer w0.3: 79.78,58.5 83.13,58.5 85.97,55.67 87.62,55.67 88.38,54.91 U31.1
DIR-A(2): length 50.1
  Bottom Layer w0.254: U25.14 69.2,26.84 79.49,37.13 79.49,40.8 85.84,47.16 U31.2
DIR-A(4): length 49.9
  Bottom Layer w0.254: U25.15 50.54,31.66 50.54,32.43 51.68,33.57 72.51,33.57 74.29,35.35 74.29,41.64 78.22,45.58 78.22,51.1 U31.4
DIR-B(14): length 20.6
  Top Layer w0.254: 62.99,38.18 62.99,31.92 U25.12
DIR-B(15): length 24.3
  Top Layer w0.254: 65.53,38.23 65.53,31.92 U25.11
PWM(3): length 45.9
  Bottom Layer w0.254: U25.16 72.93,31.92 76.96,36.75 76.96,42.71 83.31,49.06 U31.3
PWM(5): length 61.4
  Bottom Layer w0.254: 52.7,16.68 50.03,19.35 50.03,34.08 50.72,34.76 59.18,34.84 59.3,34.97 59.3,40.56 63.37,44.75 63.37,50.33 64.89,51.86 76.45,51.86 U31.5
SCL(19): length 31.7
  Top Layer w0.254: LCD1.3 61.72,61.12 61.72,51.73 63.24,50.21 63.87,50.21 U31.19
STANDYB-CONTROL(16): length 25.6
  Top Layer w0.254: U25.13 61.72,33.19 61.75,38.94 62.6,39.79 66.67,39.79 U31.16
$1N4606: length 7.9
  Top Layer w0.8: U5.3 48.53,160.44 51.48,160.44 53.21,158.72
$1N4607: length 6.9
  Top Layer w0.8: U4.3 38.87,158.28 41.52,158.28 42.67,157.14 42.67,156.89
$1N4618: length 8
  Top Layer w0.5: 13.45,148.36 13.45,149.86 14,150.41 17.49,150.38 19.15,150.41 19.55,150.01
$1N4619: length 7
  Top Layer w0.8: U3.3 26.92,155.09 R66.1
$1N4626: length 7.3
  Top Layer w0.8: 2.79,143.28 5.14,145.64 9.06,145.64
$1N4631: length 4.5
  Top Layer w0.4: HC05.4 78.35,58.83 R79.2
$1N4632: length 4.4
  Top Layer w0.4: 75.81,63.16 75.81,58.72
$1N4662: length 3.5
  Top Layer w0.254: UP4.2 70.7,141.23 71.49,140.43
$1N4664: length 4.2
  Top Layer w0.254: DOWN4.2 69.35,118.24 R62.2
$1N4665: length 3.5
  Top Layer w0.254: MODE6.2 70.37,129.29 R61.1
$1N4672: length 6.8
  Top Layer w0.254: U18.1 67.13,146.98 69.32,146.98 R54.2
$1N4684: length 3.1
  Top Layer w0.8: R73.1 99.29,153.84 U10.3
$1N4685: length 5.1
  Top Layer w0.254: 109.39,150.69 109.39,148.98 109.6,148.77 112.57,148.77 U11.3
$1N4686: length 5.9
  Top Layer w0.254: R75.1 120.26,143.81 121.23,142.84 U12.3
$1N4698: length 3.4
  Top Layer w0.8: 76.15,159.74 77.98,159.74 U8.3
$1N4699: length 3.1
  Top Layer w0.8: R72.1 90.23,157.8 U9.3
$1N4706: length 5.6
  Top Layer w0.8: U6.3 59.11,159.98 59.11,158.57 60.03,157.65 60.52,157.65
$1N4711: length 53.1
  Top Layer w1: 26.86,39.28 31.56,34.59 41.52,34.59 43.94,32.17 43.94,9.44 49.86,3.51 51.81,3.51
$1N4716: length 4.8
  Top Layer w0.5: 21.58,1.57 21.43,1.57 20.57,2.43 20.57,4.36 21.08,4.87 R53.2
$1N5383: length 86.8
  Bottom Layer w0.8: U25.6 39.11,17.69 48.46,17.69 49.65,16.51 49.65,13 50.54,12.11 102.74,12.11 107.31,16.68 114.93,16.68 MOTOR4.2
$1N5385: length 89.7
  Bottom Layer w0.8: U25.7 39.11,15.16 44.53,15.16 46.09,13.6 46.09,7.47 47.29,6.27 47.62,6.27 ; 47.56,6.22 110.36,6.01 MOTOR4.1
$1N5399: length 25.2
  Bottom Layer w0.8: MOTOR3.1 29.33,16.68 29.58,16.93 U25.4
$1N5401: length 25.4
  Bottom Layer w0.8: MOTOR3.2 29.97,14.14 U25.5
$1N10466: length 4.3
  Top Layer w0.8: U7.3 68.32,157.27

## Copper pours and planes (outline as drawn; the poured copper is in the pictures)
GND on Bottom Layer: -8.13,176.95 137.03,176.95 137.03,-5.42 -8.13,-5.42
GND on Bottom Layer: -16.14,189.02 139.06,189.02 139.06,-7.45 -16.14,-7.45

## Text on the board
Bottom Silkscreen Layer: TB6612FNG LFR BOT
